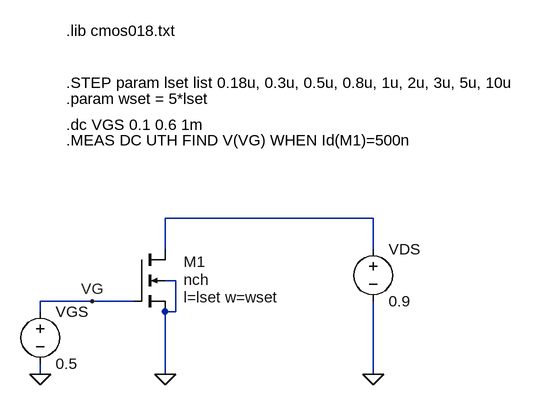
[diagram p0: schematic Draft1N.asc]
Draft1N.asc, the LTspice schematic file:
Version 4
SHEET 1 1232 680
WIRE 576 64 256 64
WIRE 256 112 256 64
WIRE 576 112 576 64
WIRE 272 160 256 160
WIRE 144 192 64 192
WIRE 208 192 144 192
WIRE 64 208 64 192
WIRE 272 208 272 160
WIRE 272 208 256 208
WIRE 64 304 64 288
WIRE 256 304 256 208
WIRE 576 304 576 192
FLAG 256 304 0
FLAG 576 304 0
FLAG 64 304 0
FLAG 144 192 VG
SYMBOL nmos4 208 112 R0
WINDOW 0 77 19 Left 2
WINDOW 3 77 47 Left 2
WINDOW 123 77 74 Left 2
SYMATTR InstName M1
SYMATTR Value nch
SYMATTR Value2 l=lset w=wset
SYMBOL voltage 576 96 R0
WINDOW 123 0 0 Left 0
WINDOW 39 0 0 Left 0
SYMATTR InstName VDS
SYMATTR Value 0.9
SYMBOL voltage 64 192 R0
WINDOW 123 0 0 Left 0
WINDOW 39 0 0 Left 0
SYMATTR InstName VGS
SYMATTR Value 0.5
TEXT 104 -224 Left 2 !.lib cmos018.txt
TEXT 104 -144 Left 2 !.STEP param lset list 0.18u, 0.3u, 0.5u, 0.8u, 1u, 2u, 3u, 5u, 10u
TEXT 104 -56 Left 2 !.MEAS DC UTH FIND V(VG) WHEN Id(M1)=500n
TEXT 104 -80 Left 2 !.dc VGS 0.1 0.6 1m
TEXT 104 -120 Left 2 !.param wset = 5*lset

The netlist it stands for:
* Draft1N.asc
M1 N001 VG 0 0 nch l=lset w=wset
VDS N001 0 0.9
VGS VG 0 0.5
.model NMOS NMOS
.model PMOS PMOS
.lib standard.mos
.lib cmos018.txt
.STEP param lset list 0.18u, 0.3u, 0.5u, 0.8u, 1u, 2u, 3u, 5u, 10u
.MEAS DC UTH FIND V(VG) WHEN Id(M1)=500n
.dc VGS 0.1 0.6 1m
.param wset = 5*lset
.backanno
.end